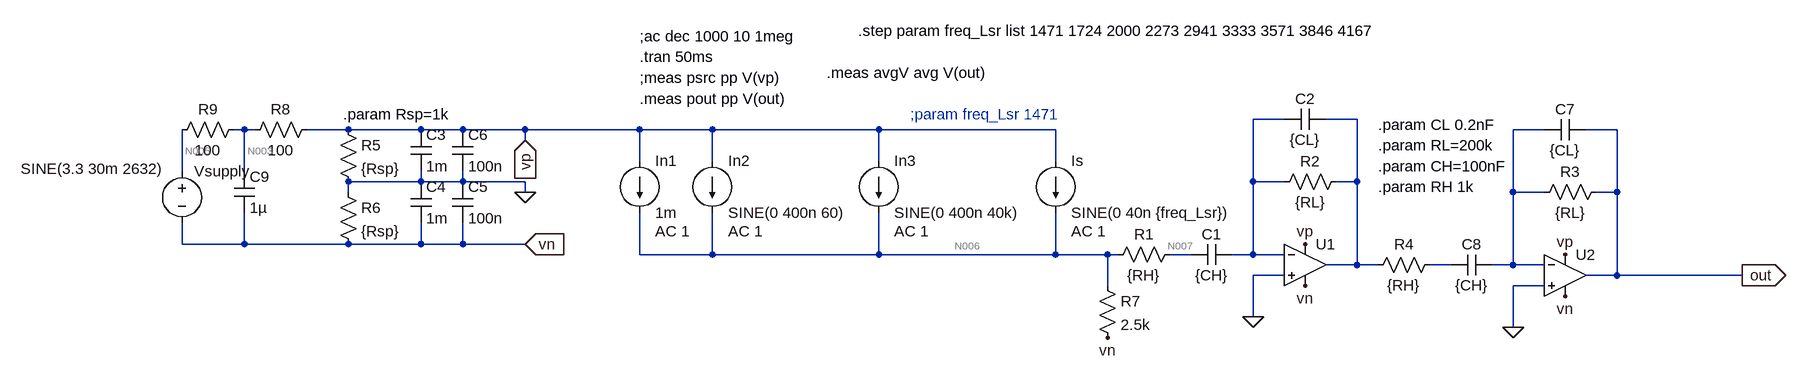
[diagram p0: schematic receiver_1A.asc]
receiver_1A.asc, the LTspice schematic file:
Version 4
SHEET 1 2360 680
WIRE 1040 64 992 64
WIRE 1152 64 1104 64
WIRE -560 80 -576 80
WIRE -544 80 -560 80
WIRE -400 80 -464 80
WIRE -288 80 -400 80
WIRE -224 80 -288 80
WIRE -128 80 -224 80
WIRE 48 80 -128 80
WIRE 160 80 48 80
WIRE 416 80 160 80
WIRE 688 80 416 80
WIRE 1440 80 1392 80
WIRE 1552 80 1504 80
WIRE -128 96 -128 80
WIRE 48 128 48 80
WIRE 160 128 160 80
WIRE 416 128 416 80
WIRE 688 128 688 80
WIRE -656 144 -656 80
WIRE -560 144 -560 80
WIRE -288 160 -288 144
WIRE -288 160 -400 160
WIRE -224 160 -224 144
WIRE -224 160 -288 160
WIRE -128 160 -224 160
WIRE 992 160 992 64
WIRE 1040 160 992 160
WIRE 1152 160 1152 64
WIRE 1152 160 1120 160
WIRE -400 176 -400 160
WIRE -128 176 -128 160
WIRE 1392 176 1392 80
WIRE 1440 176 1392 176
WIRE 1552 176 1552 80
WIRE 1552 176 1520 176
WIRE -656 256 -656 224
WIRE -560 256 -560 208
WIRE -560 256 -656 256
WIRE -400 256 -560 256
WIRE -288 256 -288 224
WIRE -288 256 -400 256
WIRE -224 256 -224 224
WIRE -224 256 -288 256
WIRE -128 256 -224 256
WIRE 48 272 48 208
WIRE 160 272 160 208
WIRE 160 272 48 272
WIRE 416 272 416 208
WIRE 416 272 160 272
WIRE 688 272 688 208
WIRE 688 272 416 272
WIRE 768 272 688 272
WIRE 784 272 768 272
WIRE 896 272 864 272
WIRE 992 272 992 160
WIRE 992 272 960 272
WIRE 1040 272 992 272
WIRE 1152 288 1152 160
WIRE 1152 288 1104 288
WIRE 1184 288 1152 288
WIRE 1296 288 1264 288
WIRE 1392 288 1392 176
WIRE 1392 288 1360 288
WIRE 1440 288 1392 288
WIRE 1040 304 992 304
WIRE 1552 304 1552 176
WIRE 1552 304 1504 304
WIRE 1744 304 1552 304
WIRE 768 320 768 272
WIRE 1440 320 1392 320
WIRE 992 368 992 304
WIRE 1392 384 1392 320
FLAG -128 256 vn
IOPIN -128 256 In
FLAG 1072 320 vn
FLAG 1072 256 vp
FLAG 1744 304 out
IOPIN 1744 304 Out
FLAG 768 400 vn
FLAG 992 368 0
FLAG 1472 336 vn
FLAG 1472 272 vp
FLAG 1392 384 0
FLAG -128 176 0
FLAG -128 96 vp
IOPIN -128 96 In
SYMBOL current 48 128 R0
WINDOW 123 24 108 Left 2
WINDOW 39 0 0 Left 0
SYMATTR Value2 AC 1
SYMATTR InstName In1
SYMATTR Value 1m
SYMBOL current 160 128 R0
WINDOW 123 24 108 Left 2
WINDOW 39 0 0 Left 0
SYMATTR Value2 AC 1
SYMATTR InstName In2
SYMATTR Value SINE(0 400n 60)
SYMBOL current 416 128 R0
WINDOW 123 24 108 Left 2
WINDOW 39 0 0 Left 0
SYMATTR Value2 AC 1
SYMATTR InstName In3
SYMATTR Value SINE(0 400n 40k)
SYMBOL current 688 128 R0
WINDOW 123 24 108 Left 2
WINDOW 39 0 0 Left 0
SYMATTR Value2 AC 1
SYMATTR InstName Is
SYMATTR Value SINE(0 40n {freq_Lsr})
SYMBOL voltage -656 128 R0
WINDOW 0 19 16 Left 2
WINDOW 123 0 0 Left 0
WINDOW 39 19 44 Left 2
WINDOW 3 -248 12 Left 2
SYMATTR InstName Vsupply
SYMATTR Value SINE(3.3 30m 2632)
SYMBOL res -416 64 R0
SYMATTR InstName R5
SYMATTR Value {Rsp}
SYMBOL res -416 160 R0
SYMATTR InstName R6
SYMATTR Value {Rsp}
SYMBOL cap -304 80 R0
SYMATTR InstName C3
SYMATTR Value 1m
SYMBOL cap -304 160 R0
SYMATTR InstName C4
SYMATTR Value 1m
SYMBOL cap -240 160 R0
SYMATTR InstName C5
SYMATTR Value 100n
SYMBOL cap -240 80 R0
SYMATTR InstName C6
SYMATTR Value 100n
SYMBOL OpAmps\\UniversalOpAmp2 1072 288 R0
SYMATTR InstName U1
SYMATTR Value2 Avol=25k GBW=1Meg Slew=0.6Meg
SYMATTR SpiceLine Ilimit=6m Rail=25m Vos=0
SYMBOL res 1136 144 R90
WINDOW 0 0 56 VBottom 2
WINDOW 3 32 56 VTop 2
SYMATTR InstName R2
SYMATTR Value {RL}
SYMBOL res 752 304 R0
SYMATTR InstName R7
SYMATTR Value 2.5k
SYMBOL cap 1104 48 R90
WINDOW 0 0 32 VBottom 2
WINDOW 3 32 32 VTop 2
SYMATTR InstName C2
SYMATTR Value {CL}
SYMBOL res 880 256 R90
WINDOW 0 0 56 VBottom 2
WINDOW 3 32 56 VTop 2
SYMATTR InstName R1
SYMATTR Value {RH}
SYMBOL cap 960 256 R90
WINDOW 0 0 32 VBottom 2
WINDOW 3 32 32 VTop 2
SYMATTR InstName C1
SYMATTR Value {CH}
SYMBOL OpAmps\\UniversalOpAmp2 1472 304 R0
SYMATTR InstName U2
SYMATTR Value2 Avol=25k GBW=1Meg Slew=0.6Meg
SYMATTR SpiceLine Ilimit=6m Rail=25m Vos=0
SYMBOL res 1536 160 R90
WINDOW 0 0 56 VBottom 2
WINDOW 3 32 56 VTop 2
SYMATTR InstName R3
SYMATTR Value {RL}
SYMBOL cap 1504 64 R90
WINDOW 0 0 32 VBottom 2
WINDOW 3 32 32 VTop 2
SYMATTR InstName C7
SYMATTR Value {CL}
SYMBOL cap 1360 272 R90
WINDOW 0 0 32 VBottom 2
WINDOW 3 32 32 VTop 2
SYMATTR InstName C8
SYMATTR Value {CH}
SYMBOL res 1280 272 R90
WINDOW 0 0 56 VBottom 2
WINDOW 3 32 56 VTop 2
SYMATTR InstName R4
SYMATTR Value {RH}
SYMBOL res -448 64 R90
WINDOW 0 0 56 VBottom 2
WINDOW 3 32 56 VTop 2
SYMATTR InstName R8
SYMATTR Value 100
SYMBOL res -560 64 R90
WINDOW 0 0 56 VBottom 2
WINDOW 3 32 56 VTop 2
SYMATTR InstName R9
SYMATTR Value 100
SYMBOL cap -576 144 R0
SYMATTR InstName C9
SYMATTR Value 1µ
TEXT -408 56 Left 2 !.param Rsp=1k
TEXT 384 -72 Left 2 !.step param freq_Lsr list 1471 1724 2000 2273 2941 3333 3571 3846 4167
TEXT 48 -64 Left 2 !;ac dec 1000 10 1meg
TEXT 48 -32 Left 2 !.tran 50ms
TEXT 48 0 Left 2 !;meas psrc pp V(vp)
TEXT 48 32 Left 2 !.meas pout pp V(out)
TEXT 1184 72 Left 2 !.param CL 0.2nF
TEXT 1184 104 Left 2 !.param RL=200k
TEXT 1184 136 Left 2 !.param CH=100nF
TEXT 1184 168 Left 2 !.param RH 1k
TEXT 336 -8 Left 2 !.meas avgV avg V(out)
TEXT 464 56 Left 2 ;;param freq_Lsr 1471

The netlist it stands for:
* receiver_1A.asc
In1 vp N006 1m AC 1
In2 vp N006 SINE(0 400n 60) AC 1
In3 vp N006 SINE(0 400n 40k) AC 1
Is vp N006 SINE(0 40n {freq_Lsr}) AC 1
Vsupply N005 vn SINE(3.3 30m 2632)
R5 vp 0 {Rsp}
R6 0 vn {Rsp}
C3 vp 0 1m
C4 0 vn 1m
C5 0 vn 100n
C6 vp 0 100n
XU1 0 N001 vp vn N002 level2 Avol=25k GBW=1Meg Slew=0.6Meg Ilimit=6m Rail=25m Vos=0 En=0 Enk=0 In=0 Ink=0 Rin=500Meg  ; pins In+ In- V+ V- OUT
R2 N002 N001 {RL}
R7 N006 vn 2.5k
C2 N002 N001 {CL}
R1 N007 N006 {RH}
C1 N001 N007 {CH}
XU2 0 N004 vp vn out level2 Avol=25k GBW=1Meg Slew=0.6Meg Ilimit=6m Rail=25m Vos=0 En=0 Enk=0 In=0 Ink=0 Rin=500Meg  ; pins In+ In- V+ V- OUT
R3 out N004 {RL}
C7 out N004 {CL}
C8 N004 N008 {CH}
R4 N008 N002 {RH}
R8 vp N003 100
R9 N003 N005 100
C9 N003 vn 1µ
.param Rsp=1k
.step param freq_Lsr list 1471 1724 2000 2273 2941 3333 3571 3846 4167
;ac dec 1000 10 1meg
.tran 50ms
;meas psrc pp V(vp)
.meas pout pp V(out)
.param CL 0.2nF
.param RL=200k
.param CH=100nF
.param RH 1k
.meas avgV avg V(out)
* ;param freq_Lsr 1471
.lib UniversalOpAmp2.lib
.backanno
.end

* Results of the author's LTspice run, read from the files saved beside the schematic
* Operating Point (first step), zero values left out:
*   freq_lsr = 1.471 k
*   V(vp) = 1.384 V
*   V(n006) = 1.116 V
*   V(n005) = 1.916 V
*   V(vn) = -1.384 V
*   V(n007) = 1.116 V
*   V(n003) = 1.65 V
*   I(In1) = 1 mA
*   I(R5) = 1.384 mA
*   I(R6) = 1.384 mA
*   I(R7) = 1 mA
*   I(R8) = -2.656 mA
*   I(R9) = -2.656 mA
*   I(Vsupply) = -2.656 mA
*   Ix(u1:3) = 135.8 µA
*   Ix(u1:4) = -135.8 µA
*   Ix(u2:3) = 135.8 µA
*   Ix(u2:4) = -135.8 µA
* From the log:
*   Measurement: pout
*     step  PP(v(out))  FROM  TO
*        1  1.68957  0  0.05
*        2  1.69281  0  0.05
*        3  1.66653  0  0.05
*        4  1.6441  0  0.05
*        5  1.47176  0  0.05
*        6  1.33147  0  0.05
*        7  1.24707  0  0.05
*        8  1.13915  0  0.05
*        9  1.02608  0  0.05
*   Measurement: avgv
*     step  AVG(v(out))  FROM  TO
*        1  0.00427926  0  0.05
*        2  0.00233947  0  0.05
*        3  0.00194184  0  0.05
*        4  0.00380507  0  0.05
*        5  0.00255828  0  0.05
*        6  0.00336268  0  0.05
*        7  0.00312463  0  0.05
*        8  0.00266694  0  0.05
*        9  0.0027443  0  0.05